# EAGLE schematic V-00716-01 (EAGLE 7.2.0)
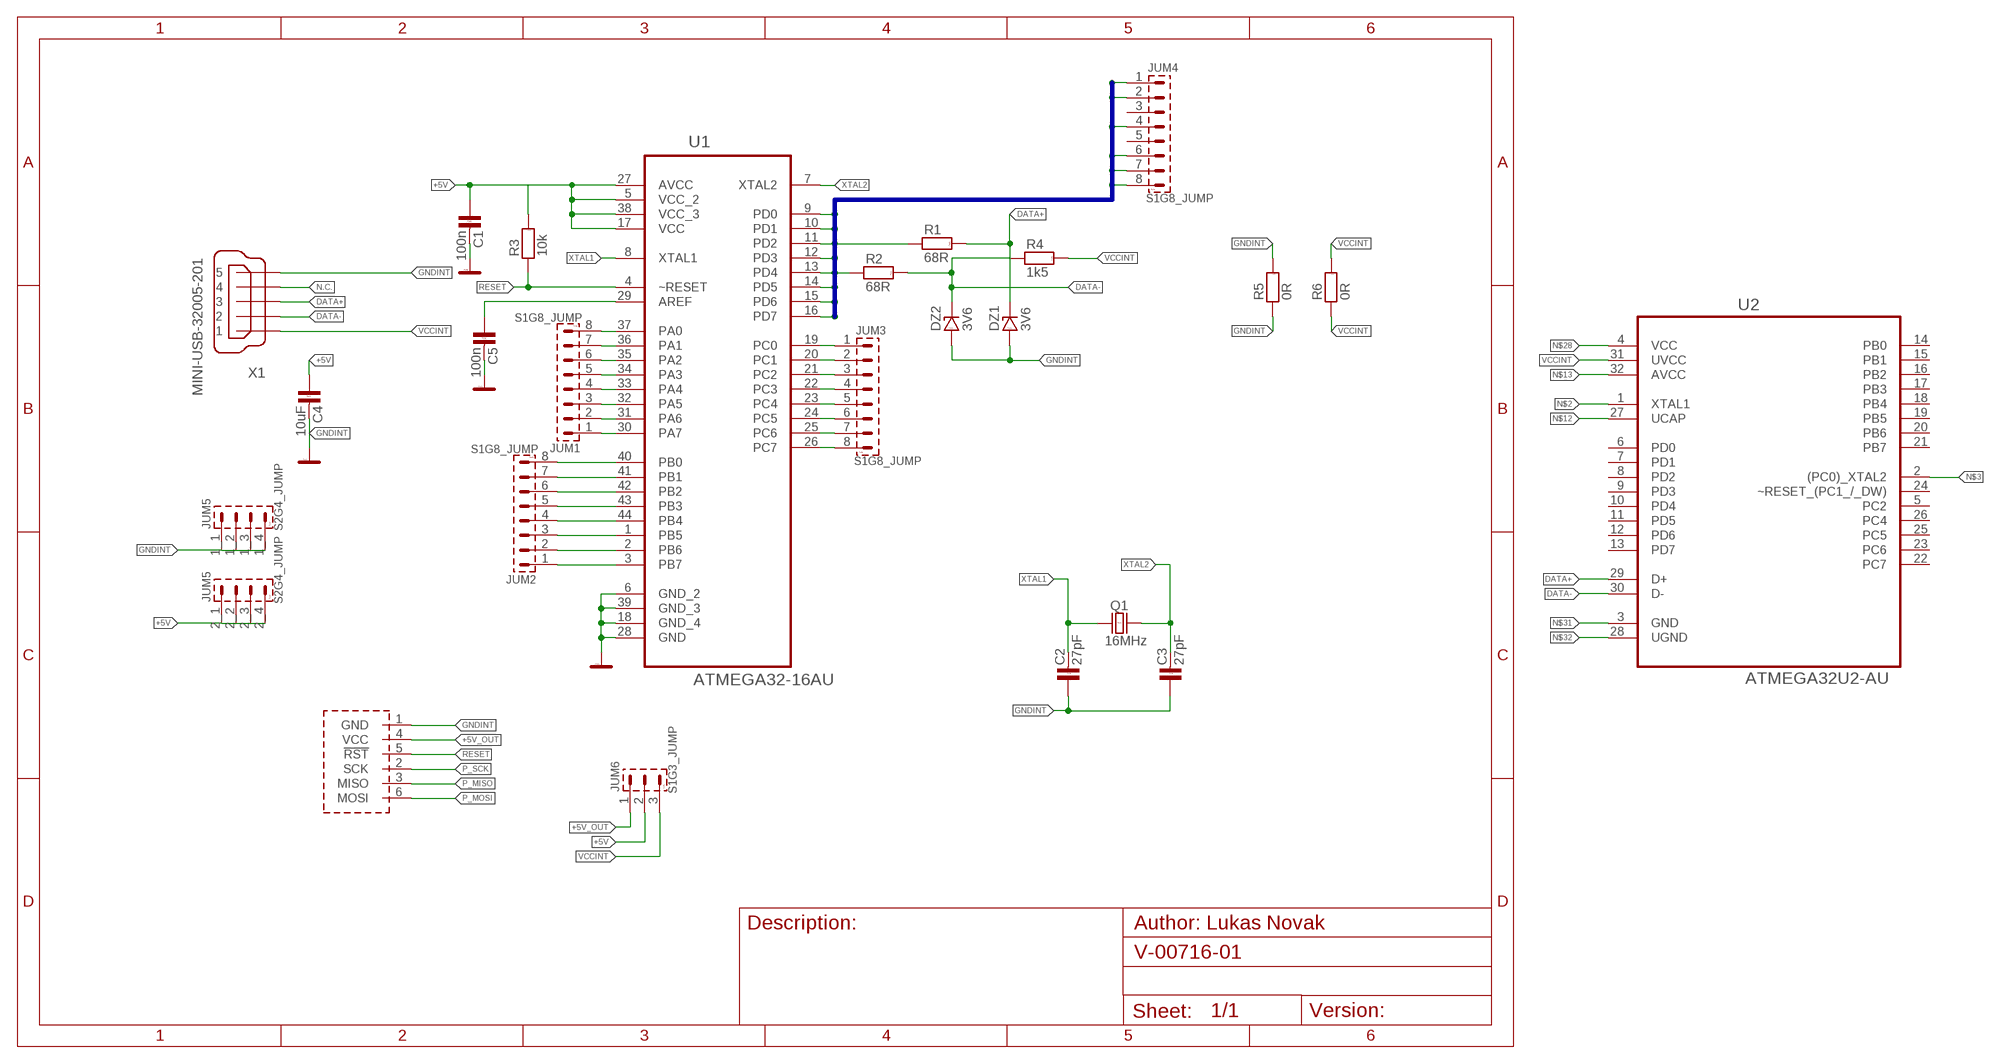
[diagram p0: schematic, sheet 1]

## Parts
C1  100n  C-KER_1206  [1206]
C2  27pF  C-KER_0805  [0805]
C3  27pF  C-KER_0805  [0805]
C4  10uF  C-KER_1206  [1206]
C5  100n  C-KER_1206  [1206]
DZ1  3V6  D-BZV55C_SMD_0,5W-ZENER  [SOD-80]
DZ2  3V6  D-BZV55C_SMD_0,5W-ZENER  [SOD-80]
JUM1  S1G8_JUMP  [S1G8_JUM]
JUM2  S1G8_JUMP  [S1G8_JUM]
JUM3  S1G8_JUMP  [S1G8_JUM]
JUM4  S1G8_JUMP  [S1G8_JUM]
JUM5  S2G4_JUMP  [S2G4_JUM]
JUM6  S1G3_JUMP  [S1G3_JUM]
Q1  16MHz  Q_HC-49U  [HC-49U]
R1  68R  R_1206  [1206]
R2  68R  R_1206  [1206]
R3  10k  R_1206  [1206]
R4  1k5  R_1206  [1206]
R5  0R  R_1206  [1206]
R6  0R  R_1206  [1206]
U1  ATMEGA32-16AU  [QFP80P1200X1200X120-44N]
U2  ATMEGA32U2-AU  [QFP80P900X900X120-32N]
U$1  AVR_PROG_SPI  [PSH02-06P]
X1  MINI-USB-32005-201  [32005-201]

## Nets
+5V: C1.1 C4.1 JUM5.2_1 JUM5.2_2 JUM5.2_3 JUM5.2_4 JUM6.2 R3.2 U1.5(VCC_2) U1.17(VCC) U1.27(AVCC) U1.38(VCC_3)
+5V_OUT: JUM6.1 U$1.4(VCC)
DATA+: DZ1.K R1.2 U2.29(D+) X1.3
DATA-: DZ2.K R2.2 R4.1 U2.30(D-) X1.2
GNDINT: C1.2 C2.1 C3.1 C4.2 C5.2 DZ1.A DZ2.A JUM5.1_1 JUM5.1_2 JUM5.1_3 JUM5.1_4 R5.1 R5.2 U1.6(GND_2) U1.18(GND_4) U1.28(GND) U1.39(GND_3) U$1.1(GND) X1.5 ; supply symbol labelled GND
N$1: C5.1 U1.29(AREF)
N$2: U2.1(XTAL1)
N$3: U2.2((PC0)_XTAL2)
N$4: JUM1.1 U1.30(PA7)
N$5: JUM1.2 U1.31(PA6)
N$6: JUM1.3 U1.32(PA5)
N$7: JUM1.4 U1.33(PA4)
N$8: JUM1.5 U1.34(PA3)
N$9: JUM1.6 U1.35(PA2)
N$10: JUM1.7 U1.36(PA1)
N$11: JUM1.8 U1.37(PA0)
N$12: U2.27(UCAP)
N$13: U2.32(AVCC)
N$15: JUM2.4 U1.44(PB4)
N$16: JUM2.5 U1.43(PB3)
N$17: JUM2.6 U1.42(PB2)
N$18: JUM2.7 U1.41(PB1)
N$19: JUM2.8 U1.40(PB0)
N$20: JUM3.1 U1.19(PC0)
N$21: JUM3.2 U1.20(PC1)
N$22: JUM3.3 U1.21(PC2)
N$23: JUM3.4 U1.22(PC3)
N$24: JUM3.5 U1.23(PC4)
N$25: JUM3.6 U1.24(PC5)
N$26: JUM3.7 U1.25(PC6)
N$27: JUM3.8 U1.26(PC7)
N$28: U2.4(VCC)
N$31: U2.3(GND)
N$32: U2.28(UGND)
N.C.: X1.4
P_MISO: JUM2.2 U1.2(PB6) U$1.3(MISO)
P_MOSI: JUM2.3 U1.1(PB5) U$1.6(MOSI)
P_SCK: JUM2.1 U1.3(PB7) U$1.2(SCK)
PD0: JUM4.1 U1.9(PD0)
PD1: JUM4.2 U1.10(PD1)
PD2: R1.1 U1.11(PD2)
PD3: JUM4.4 U1.12(PD3)
PD4: R2.1 U1.13(PD4)
PD5: JUM4.6 U1.14(PD5)
PD6: JUM4.7 U1.15(PD6)
PD7: JUM4.8 U1.16(PD7)
RESET: R3.1 U1.4(~RESET) U$1.5(!RST)
VCCINT: JUM6.3 R4.2 R6.1 R6.2 U2.31(UVCC) X1.1
XTAL1: C2.2 Q1.1 U1.8(XTAL1)
XTAL2: C3.2 Q1.2 U1.7(XTAL2)
Unconnected: JUM4.3 JUM4.5 U2.5(PC2) U2.6(PD0) U2.7(PD1) U2.8(PD2) U2.9(PD3) U2.10(PD4) U2.11(PD5) U2.12(PD6) U2.13(PD7) U2.14(PB0) U2.15(PB1) U2.16(PB2) U2.17(PB3) U2.18(PB4) U2.19(PB5) U2.20(PB6) U2.21(PB7) U2.22(PC7) U2.23(PC6) U2.24(~RESET_(PC1_/_DW)) U2.25(PC5) U2.26(PC4)

## Buses
PD[0..7]

## Library data of the parts
C1-C5 = #PaJa_31:C-KER: Kondenzator - keramicky
DZ1 DZ2 = #PaJa_31:D-?-ZENER: Zenerova dioda
JUM1-JUM4 = #PaJa_konektory:S1G8_JUMP: Radove konektory - koliky - 8x
JUM5 = #PaJa_konektory:S2G4_JUMP: Radove konektory - koliky - dvojite - 2x4
JUM6 = #PaJa_konektory:S1G3_JUMP: Radove konektory - koliky - 3x
Q1 = #PaJa_31:Q: Krystal HC-49 - 1MHz - 48MHz DT38 - Quartz (hodinovy) 32,768kHz
R1-R6 = #PaJa_31:R: Rezistor
U1 = #_Atmel_By_element14_Batch_1-00:ATMEGA32-16AU: Microcontroller with Programmable Flash; MPN: ATMEGA32-16AU; OC_FARNELL: 9171274; OC_NEWARK: 69K6677; PACKAGE: TQFP-44; SUPPLIER: Atmel
U2 = #_Atmel_By_element14_Batch_1-00:ATMEGA32U2-AU: 8-bit Microcontroller with ISP Flash and USB Controller; MPN: ATMEGA32U2-AU; OC_FARNELL: 1748524; OC_NEWARK: 26R5632; PACKAGE: TQFP-32; SUPPLIER: Atmel
U$1 = #PaJa_konektory:AVR_PROG_SPI
X1 = con-cypressindustries:MINI-USB-: MINI USB-B Conector Source: www.cypressindustries.com; OC_FARNELL: unknown; OC_NEWARK: unknown